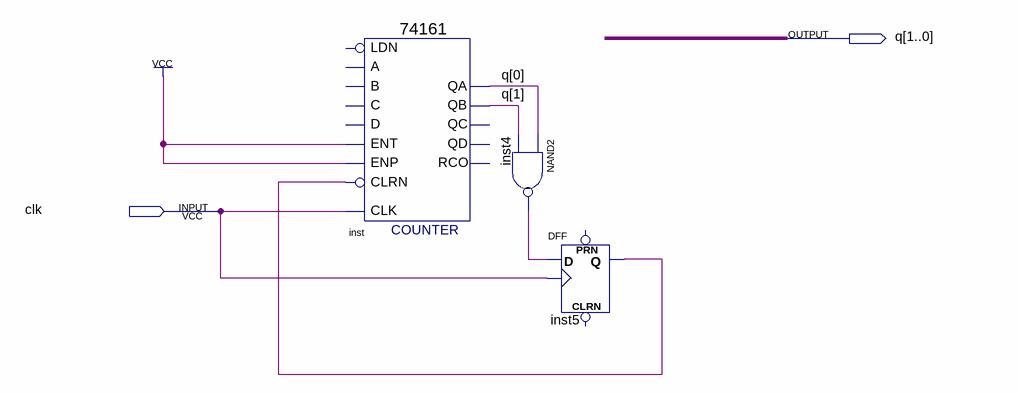
[diagram p0: schematic sheet]
// Quartus schematic counter4.bdf as structural Verilog: 3 symbols, 2 pins
module counter4 (
  input  clk,
  output [1:0] q
);

  wire inst4_out, inst5_q;

  \74161  inst (
    .CLRN(inst5_q), .CLK(clk), .ENP(1'b1), .ENT(1'b1), .QB(q[1]), .QA(q[0]));  // open: LDN, A, D, B, C, QD, QC, RCO
  nand inst4 (inst4_out, q[0], q[1]);
  DFF inst5 (.CLK(clk), .D(inst4_out), .Q(inst5_q));  // open: CLRN, PRN
endmodule
